# EAGLE design h_bridge (EAGLE 7.5.0)
CNAME: H-Bridge; DESIGNER: FEE ROBOTICS CLUB 2019
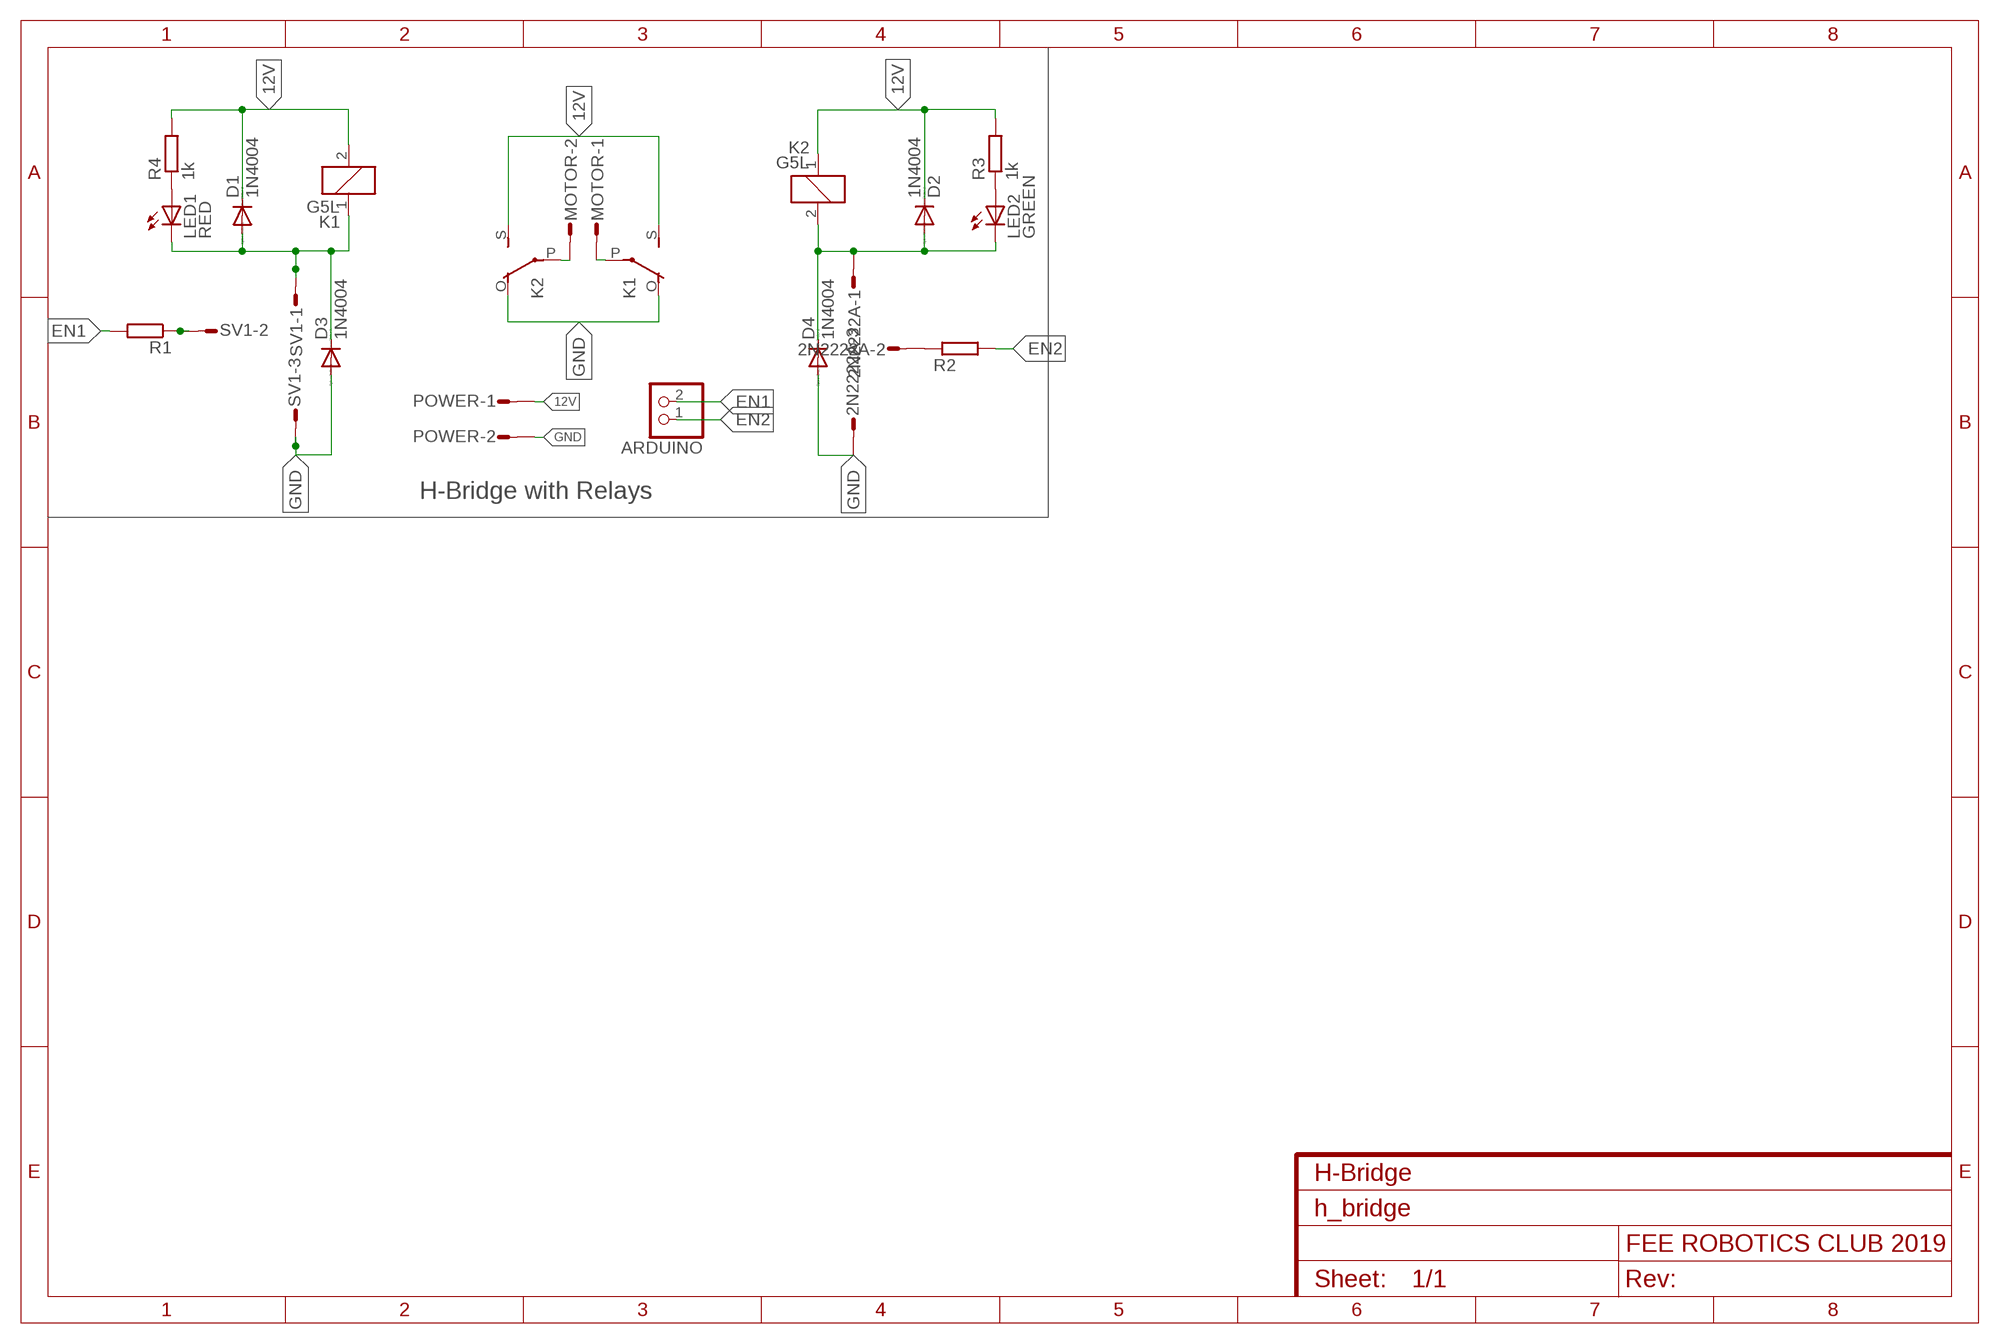
[diagram p0: schematic, sheet 1]

## Parts
2N2222A  MT6-3  [MT6-3]
ARDUINO  PINHD-1X2  [1X02]
D1  1N4004  [DO41-10]
D2  1N4004  [DO41-10]
D3  1N4004  [DO41-10]
D4  1N4004  [DO41-10]
K1  G5L  [G5LE]
K2  G5L  [G5LE]
LED1  RED  LED3MM  [LED3MM]
LED2  GREEN  LED3MM  [LED3MM]
MOTOR  L02P  [L02P]
POWER  L02P  [L02P]
R1  R-EU_0207/7  [0207/7]
R2  R-EU_0207/7  [0207/7]
R3  1k  R-EU_0207/7  [0207/7]
R4  1k  R-EU_0207/7  [0207/7]
SV1  MT6-3  [MT6-3]

## Nets
12V: D1.C D2.C K1.2 K1.S(2:S) K2.1 K2.S(2:S) POWER.1 R3.2 R4.2
EN1: ARDUINO.2 R1.2
EN2: ARDUINO.1 R2.2
GND: 2N2222A.3 D3.A D4.A K1.O(2:O) K2.O(2:O) POWER.2 SV1.3
N$1: R1.1 SV1.2
N$2: D1.A D3.C K1.1 LED1.K(C) SV1.1
N$3: 2N2222A.2 R2.1
N$4: LED2.A R3.1
N$5: 2N2222A.1 D2.A D4.C K2.2 LED2.K(C)
N$6: LED1.A R4.1
N$7: K2.P(2:P) MOTOR.2
N$8: K1.P(2:P) MOTOR.1

## Notes on the sheet
- H-Bridge with Relays

## Library data of the parts
2N2222A SV1 = con-amp-mt6:MT6-3: AMP MT6 CONNECTOR; OC_FARNELL: unknown; OC_NEWARK: unknown
ARDUINO = pinhead:PINHD-1X2: PIN HEADER
D1-D4 = diode:1N4004: DIODE general purpose rectifier, 1 A
K1 K2 = relay:G5L: RELAY 1 x switch, 10 A/120 V AC, 8 A/30 V ADC, Omron; OC_FARNELL: unknown; OC_NEWARK: unknown
LED1 LED2 = led:LED: LED OSRAM: - CHIPLED LG R971, LG N971, LY N971, LG Q971, LY Q971, LO R971, LY R971 LH N974, LH R974 LS Q976, LO Q976, LY Q976 LO Q996 - Hyper CHIPLED LW Q18S LB Q993, LB Q99A, LB R99A - SideLED LS A670, LO A670, LY A670, LG A670, LP A670 LB A673, LV A673, LT A673, LW A673 LH A674 LY A675 LS A676, LA A676, LO A676, LY A676, LW A676 LS A679, LY A679, LG A679 - Hyper Micro SIDELED® LS Y876, LA Y876, LO Y876, LY Y876 LT Y87S - SmartLED LW L88C, LW L88S LB L89C, LB L89S, LG L890 LS L89K, LO L89K, LY L89K LS L896, LA L896, LO L896, LY L896 - TOPLED LS T670, LO T670, LY T670, LG T670, LP T670 LSG T670, LSP T670, LSY T670, LOP T670, LYG T670 LG T671, LOG T671, LSG T671 LB T673, LV T673, LT T673, LW T673 LH T674 LS T676, LA T676, LO T676, LY T676, LB T676, LH T676, LSB T676, LW T676 LB T67C, LV T67C, LT T67C, LS T67K, LO T67K, LY T67K, LW E67C LS E67B, LA E67B, LO E67B, LY E67B, LB E67C, LV E67C, LT E67C LW T67C LS T679, LY T679, LG T679 LS T770, LO T770, LY T770, LG T770, LP T770 LB T773, LV T773, LT T773, LW T773 LH T774 LS E675, LA E675, LY E675, LS T675 LS T776, LA T776, LO T776, LY T776, LB T776 LHGB T686 LT T68C, LB T68C - Hyper Mini TOPLED® LB M676 - Mini TOPLED Santana® LG M470 LS M47K, LO M47K, LY M47K Source: http://www.osram.convergy.de LUXEON: - LUMILED® LXK2-PW12-R00, LXK2-PW12-S00, LXK2-PW14-U00, LXK2-PW14-V00 LXK2-PM12-R00, LXK2-PM12-S00, LXK2-PM14-U00 LXK2-PE12-Q00, LXK2-PE12-R00, LXK2-PE12-S00, LXK2-PE14-T00, LXK2-PE14-U00 LXK2-PB12-K00, LXK2-PB12-L00, LXK2-PB12-M00, LXK2-PB14-N00, LXK2-PB14-P00, LXK2-PB14-Q00 LXK2-PR12-L00, LXK2-PR12-M00, LXK2-PR14-Q00, LXK2-PR14-R00 LXK2-PD12-Q00, LXK2-PD12-R00, LXK2-PD12-S00 LXK2-PH12-R00, LXK2-PH12-S00 LXK2-PL12-P00, LXK2-PL12-Q00, LXK2-PL12-R00 Source: www.luxeon.com KINGBRIGHT: KA-3528ASYC Source: www.kingbright.com
MOTOR POWER = con-amp-mt:L02P: AMP MT CONNECTOR; OC_FARNELL: unknown; OC_NEWARK: unknown
R1-R4 = resistor:R-EU_: RESISTOR, European symbol

## Board
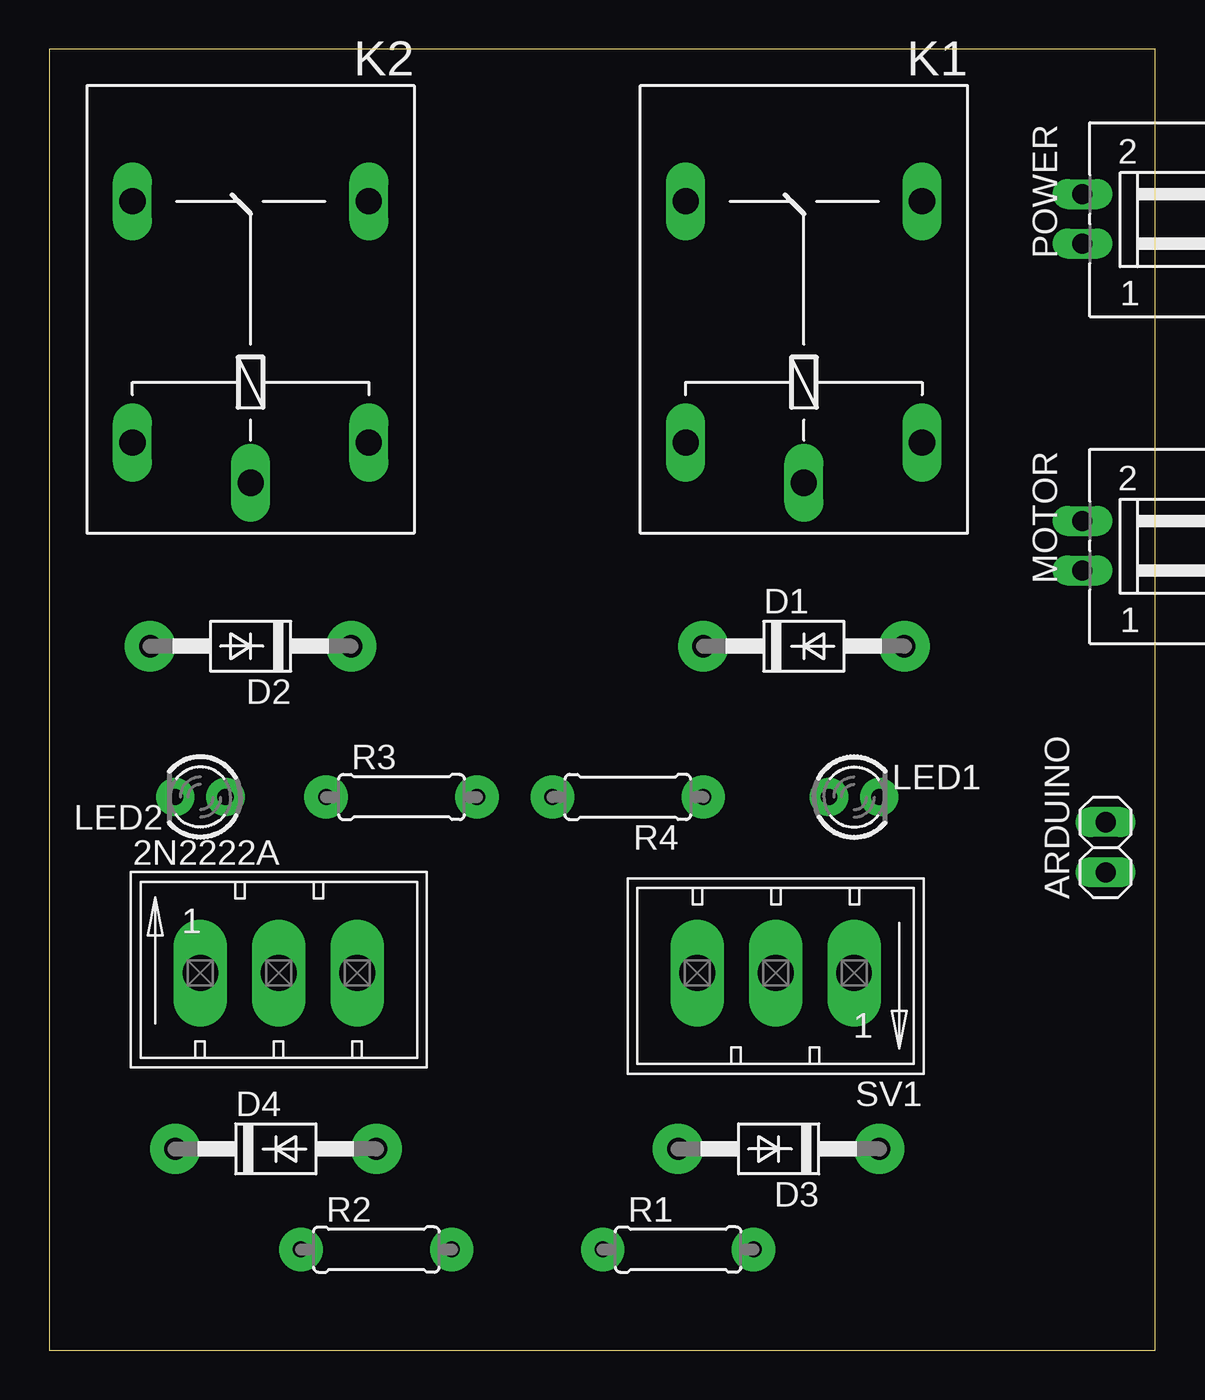
[diagram p1: board, top side]
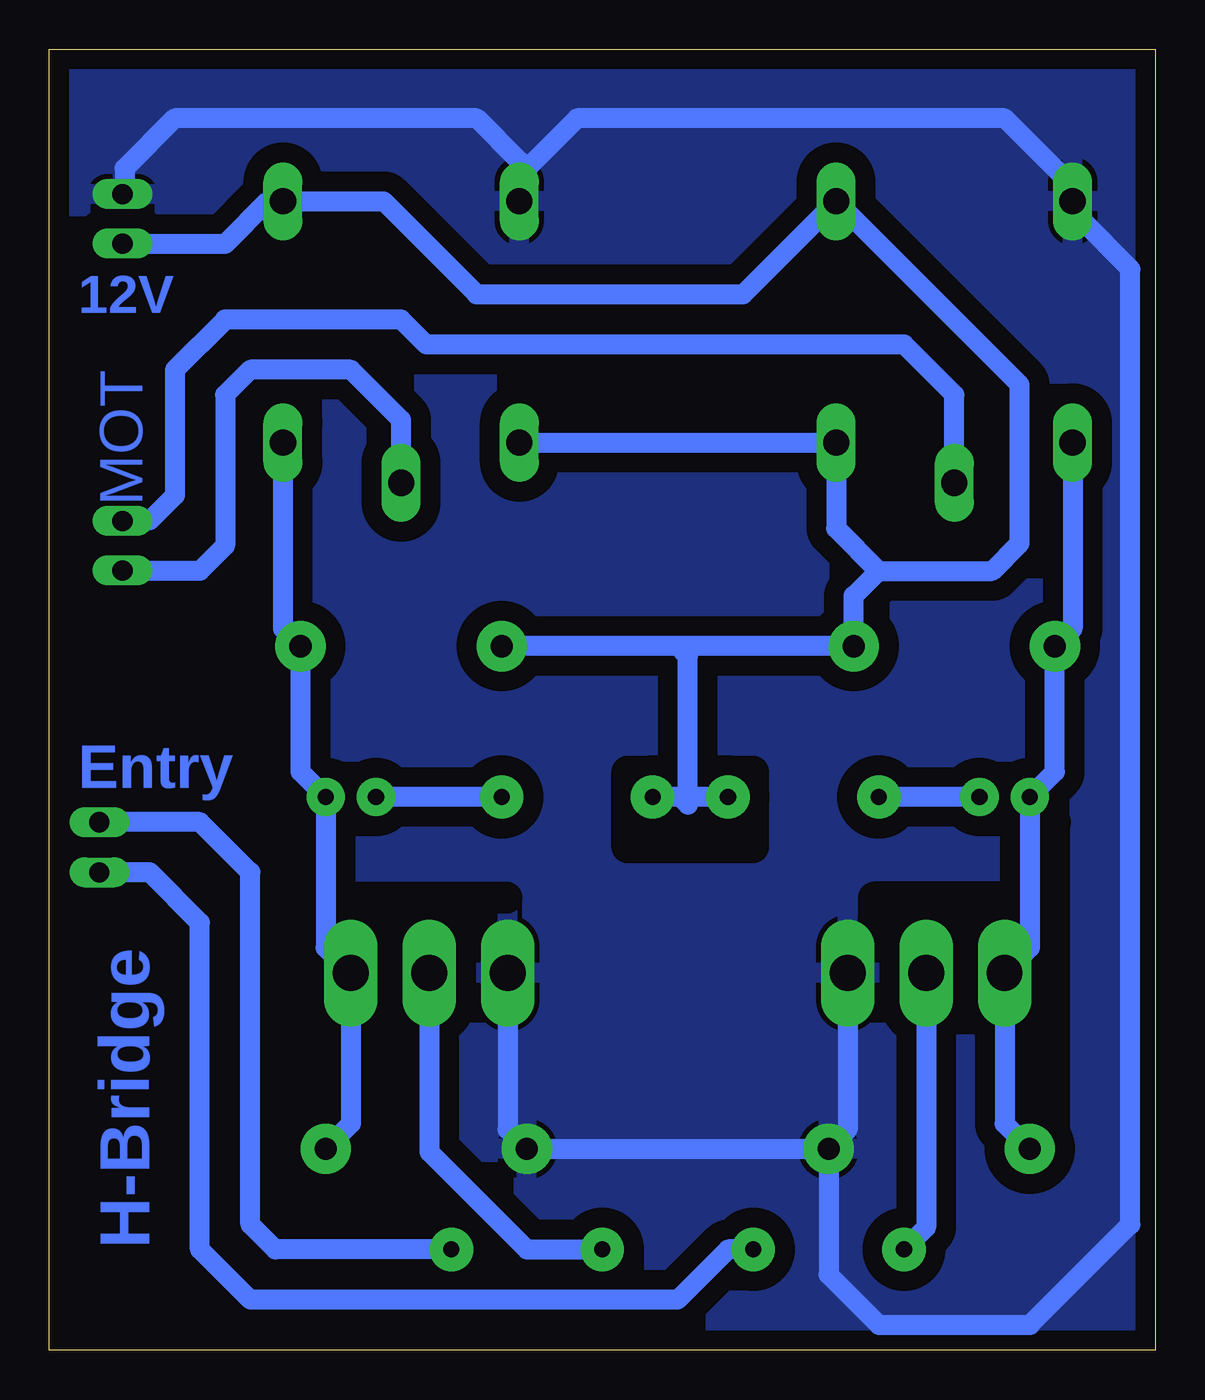
[diagram p2: board, bottom side, seen from below]

Size 55.86 x 65.71 mm. Coordinates in mm from the lower left corner, seen from the top.
Outline: 0,0 55.86,0 55.86,65.71 0,65.71 0,0
Copper layers (1*16): Top 0.035mm / dielectric 1.5mm / Bottom 0.035mm
Design rules "default": minimum track width 1mm, minimum drill 0.2mm, track to track 1mm, track to pad 1mm, pad to pad 1mm, via to via 1mm, smd to smd 8mil, copper to edge 1mm, drill to drill 1mm, minimum pad ring 10mil, minimum via ring 8mil, stop-mask expansion 4mil, vias tented up to drill 0mil, thermal gap 10mil
bRestrict: 8 lines

### Footprints (pad centres in the part's own frame; a part is rotated, then mirrored left to right if it is on the bottom)
MT6-3 = drill 1.803 long: 1 2.54,0; 2 6.502,0; 3 10.465,0
1X02 = drill 1.016 long: 1 -1.27,0; 2 1.27,0
DO41-10 = drill 1.118 pad 2.54: A 5.08,0; C -5.08,0
G5LE = drill 1.321 long: 1 -7.493,-5.969; 2 -7.493,5.969; O 4.699,5.969; P -9.525,0; S 4.699,-5.969
LED3MM = drill 0.813 pad 1.93: A -1.27,0; K 1.27,0
L02P = drill 1.016 long: 1 1.25,-6.25; 2 -1.25,-6.25
0207/7 = drill 0.813 pad 2.184: 1 -3.81,0; 2 3.81,0

### Placement (x,y rotation side)
2N2222A  5.08,19.05 0 top
ARDUINO  53.34,25.4 90 top
D1  38.1,35.56 0 top
D2  10.16,35.56 180 top
D3  36.83,10.16 180 top
D4  11.43,10.16 0 top
K1  38.1,53.34 90 top
K2  10.16,53.34 90 top
LED1  40.64,27.94 0 top
LED2  7.62,27.94 180 top
MOTOR  58.42,40.64 270 top
POWER  58.42,57.15 270 top
R1  31.75,5.08 0 top
R2  16.51,5.08 0 top
R3  17.78,27.94 0 top
R4  29.21,27.94 180 top
SV1  43.18,19.05 180 top

### Tracks (layer width: path | path; a pad name or v marks a point on that pad's centre or on a via)
12V
  Bottom 1.016: POWER.1 52.15,55.88 46.99,55.88 44.83,58.04 K1.S 38.99,58.04 34.29,53.34 20.83,53.34 K2.S 6.86,48.77 6.86,40.77 8.26,39.37 13.97,39.37 | K1.2 K2.1 16.13,41.53 13.97,39.37 | 24,27.94 R4.2 | 24.13,35.56 D2.C 15.24,38.1 13.97,39.37 | 24.13,35.56 D1.C | R3.2 24,27.94 | 24,27.94 23.62,27.56 23.62,35.05 24.13,35.56
EN1
  Bottom 1.016: R1.2 44.45,5.08 45.72,6.35 45.72,24.13 48.26,26.67 ARDUINO.2
EN2
  Bottom 1.016: R2.2 21.59,5.08 24.13,2.54 45.72,2.54 48.26,5.08 48.26,21.59 50.8,24.13 ARDUINO.1
GND
  Bottom 1.016: POWER.2 52.07,58.5 52.07,59.69 49.53,62.23 34.29,62.23 32.13,60.07 K1.O 31.75,58.42 31.75,59.69 29.21,62.23 7.62,62.23 4.19,58.8 K2.O 3.81,57.66 3.81,57.15 1.27,54.61 1.27,6.35 6.35,1.27 13.97,1.27 16.51,3.81 D4.A | SV1.3 32.72,11.12 D3.A D4.A | 2N2222A.3 15.54,11.12 D4.A
  pour Bottom (isolate 0.305): 0,66.04 55.88,66.04 55.88,0 0,0
N$1
  Bottom 1.016: SV1.2 36.68,10.01 31.75,5.08 R1.1
N$2
  Bottom 1.016: K1.1 44.07,36.45 D1.A 43.18,29.21 LED1.K 41.91,20.32 SV1.1 40.64,11.43 D3.C
N$3
  Bottom 1.016: 2N2222A.2 11.58,6.2 R2.1
N$4
  Bottom 1.016: LED2.A R3.1
N$5
  Bottom 1.016: K2.2 4.19,36.45 D2.A 5.08,29.21 LED2.K 6.35,20.32 2N2222A.1 7.62,11.43 D4.C
N$6
  Bottom 1.016: R4.1 LED1.A
N$7
  Bottom 1.016: K2.P 10.16,48.26 12.7,50.8 36.83,50.8 38.1,52.07 46.99,52.07 49.53,49.53 49.53,43.18 50.8,41.91 52.15,41.91 MOTOR.2
N$8
  Bottom 1.016: K1.P 38.1,46.99 40.64,49.53 45.72,49.53 46.99,48.26 46.99,40.64 48.26,39.37 52.15,39.37 MOTOR.1

### Text on the board
Bottom: 12V | MOT | Entry | H-Bridge